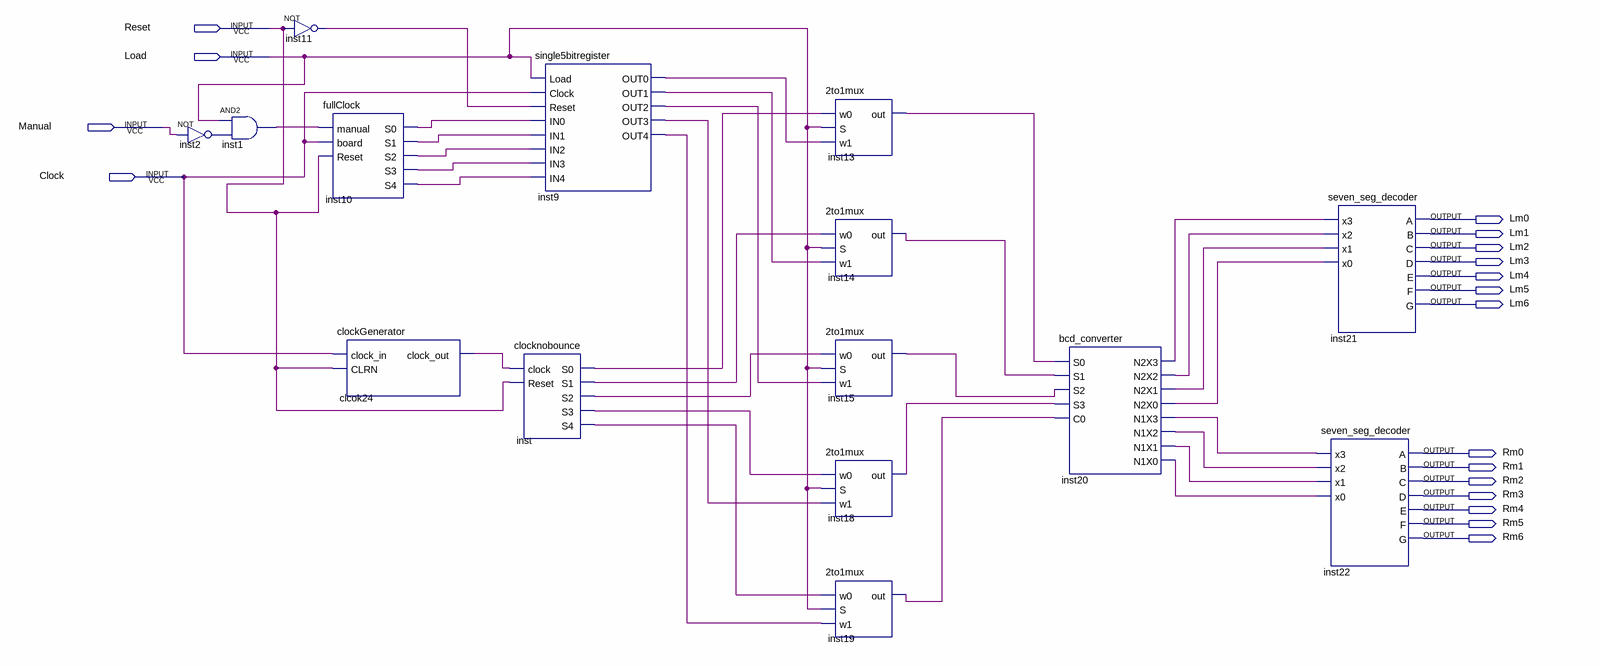
[diagram p0: schematic sheet]
// Quartus schematic alarmclock.bdf as structural Verilog: 15 symbols, 18 pins
module alarmclock (
  input  Reset,
  input  Load,
  input  Manual,
  input  Clock,
  output Lm0,
  output Lm1,
  output Lm2,
  output Lm3,
  output Lm4,
  output Lm5,
  output Lm6,
  output Rm0,
  output Rm1,
  output Rm2,
  output Rm3,
  output Rm4,
  output Rm5,
  output Rm6
);

  wire clcok24_clock_out, inst1_out, inst2_out, inst9_out0, inst9_out1, inst9_out2, inst9_out3, inst9_out4,
       inst10_s0, inst10_s1, inst10_s2, inst10_s3, inst10_s4, inst11_out, inst13_out, inst14_out, inst15_out,
       inst18_out, inst19_out, inst20_n1x0, inst20_n1x1, inst20_n1x2, inst20_n1x3, inst20_n2x0, inst20_n2x1,
       inst20_n2x2, inst20_n2x3, inst_s0, inst_s1, inst_s2, inst_s3, inst_s4;

  not inst2 (inst2_out, Manual);
  and inst1 (inst1_out, Load, inst2_out);
  not inst11 (inst11_out, Reset);
  fullClock inst10 (
    .manual(inst1_out), .board(Clock), .Reset(Reset), .S0(inst10_s0), .S1(inst10_s1), .S2(inst10_s2),
    .S3(inst10_s3), .S4(inst10_s4));
  clockGenerator clcok24 (.clock_in(Clock), .CLRN(Reset), .clock_out(clcok24_clock_out));
  clocknobounce inst (
    .clock(clcok24_clock_out), .Reset(Reset), .S0(inst_s0), .S1(inst_s1), .S2(inst_s2), .S3(inst_s3),
    .S4(inst_s4));
  single5bitregister inst9 (
    .Load(Load), .Clock(Clock), .Reset(inst11_out), .IN0(inst10_s0), .IN1(inst10_s1), .IN2(inst10_s2),
    .IN3(inst10_s3), .IN4(inst10_s4), .OUT0(inst9_out0), .OUT1(inst9_out1), .OUT2(inst9_out2),
    .OUT3(inst9_out3), .OUT4(inst9_out4));
  \2to1mux  inst13 (.w0(inst_s0), .S(Load), .w1(inst9_out0), .out(inst13_out));
  \2to1mux  inst14 (.w0(inst_s1), .S(Load), .w1(inst9_out1), .out(inst14_out));
  \2to1mux  inst15 (.w0(inst_s2), .S(Load), .w1(inst9_out2), .out(inst15_out));
  \2to1mux  inst18 (.w0(inst_s3), .S(Load), .w1(inst9_out3), .out(inst18_out));
  \2to1mux  inst19 (.w0(inst_s4), .S(Load), .w1(inst9_out4), .out(inst19_out));
  bcd_converter inst20 (
    .S0(inst13_out), .S1(inst14_out), .S2(inst15_out), .S3(inst18_out), .C0(inst19_out), .N2X3(inst20_n2x3),
    .N2X2(inst20_n2x2), .N2X1(inst20_n2x1), .N2X0(inst20_n2x0), .N1X3(inst20_n1x3), .N1X2(inst20_n1x2),
    .N1X1(inst20_n1x1), .N1X0(inst20_n1x0));
  seven_seg_decoder inst22 (
    .x3(inst20_n1x3), .x2(inst20_n1x2), .x1(inst20_n1x1), .x0(inst20_n1x0), .A(Rm0), .B(Rm1), .C(Rm2),
    .D(Rm3), .E(Rm4), .F(Rm5), .G(Rm6));
  seven_seg_decoder inst21 (
    .x3(inst20_n2x3), .x2(inst20_n2x2), .x1(inst20_n2x1), .x0(inst20_n2x0), .A(Lm0), .B(Lm1), .C(Lm2),
    .D(Lm3), .E(Lm4), .F(Lm5), .G(Lm6));
endmodule
